# Altium schematic sheet sb-sonata-mech.SchDoc: Mechanical & Title Page
size Letter; Organization: NewAE Technology Inc.; Address1: 1083 Queen St., Suite 196; Address2: Halifax; Address3: NS; Address4: Canada B3H 0B2; SheetNumber: 1; SheetTotal: 20; SheetApproved: YES
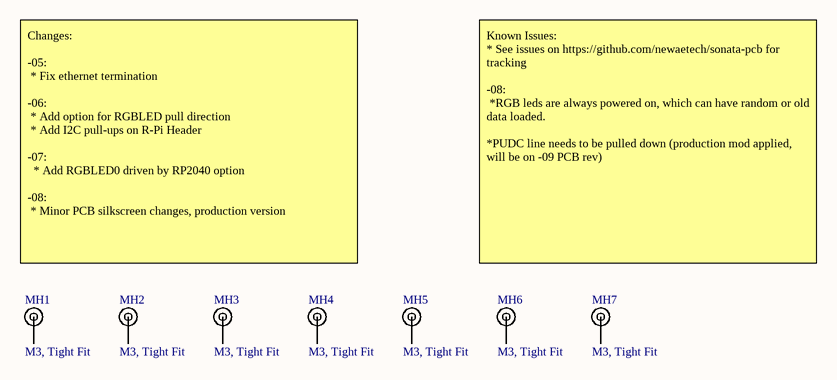
[diagram p0: sb-sonata-mech.SchDoc]

## Parts
MH1  M3, Tight Fit  [MOUNT_M3_TIGHT]
MH2  M3, Tight Fit  [MOUNT_M3_TIGHT]
MH3  M3, Tight Fit  [MOUNT_M3_TIGHT]
MH4  M3, Tight Fit  [MOUNT_M3_TIGHT]
MH5  M3, Tight Fit  [MOUNT_M3_TIGHT]
MH6  M3, Tight Fit  [MOUNT_M3_TIGHT]
MH7  M3, Tight Fit  [MOUNT_M3_TIGHT]

## Nets

Not connected (* = marked no-connect by the designer): MH1 1; MH2 1; MH3 1; MH4 1; MH5 1; MH6 1; MH7 1

## Notes on the sheet
- Changes:
  -05:
  * Fix ethernet termination
  -06:
  * Add option for RGBLED pull direction
  * Add I2C pull-ups on R-Pi Header
  -07:
  * Add RGBLED0 driven by RP2040 option
  -08:
  * Minor PCB silkscreen changes, production version
- Known Issues:
  * See issues on https://github.com/newaetech/sonata-pcb for tracking
  -08:
  *RGB leds are always powered on, which can have random or old data loaded.
  *PUDC line needs to be pulled down (production mod applied, will be on -09 PCB rev)
- Title:
- Date:
- Rev:
- Time:
- Project:
- Sheet
- of
- License:
- Copyright © NewAE Technology Inc.
- Approved:
- NewAE.com
- File:

## Library data of the parts
MH1-MH7 = MOUNT_M3_TIGHT: Machine screw M3 Mounting Hole; Component Group: Mechanical; PP Material Stack: 0; Part Number: MOUNT_M3_TIGHT; Pin Count: 1; Component Kind: Mechanical; Component Type: Mechanical; PP Rotation: 0